# Altium project PCB_Project1.PrjPCB
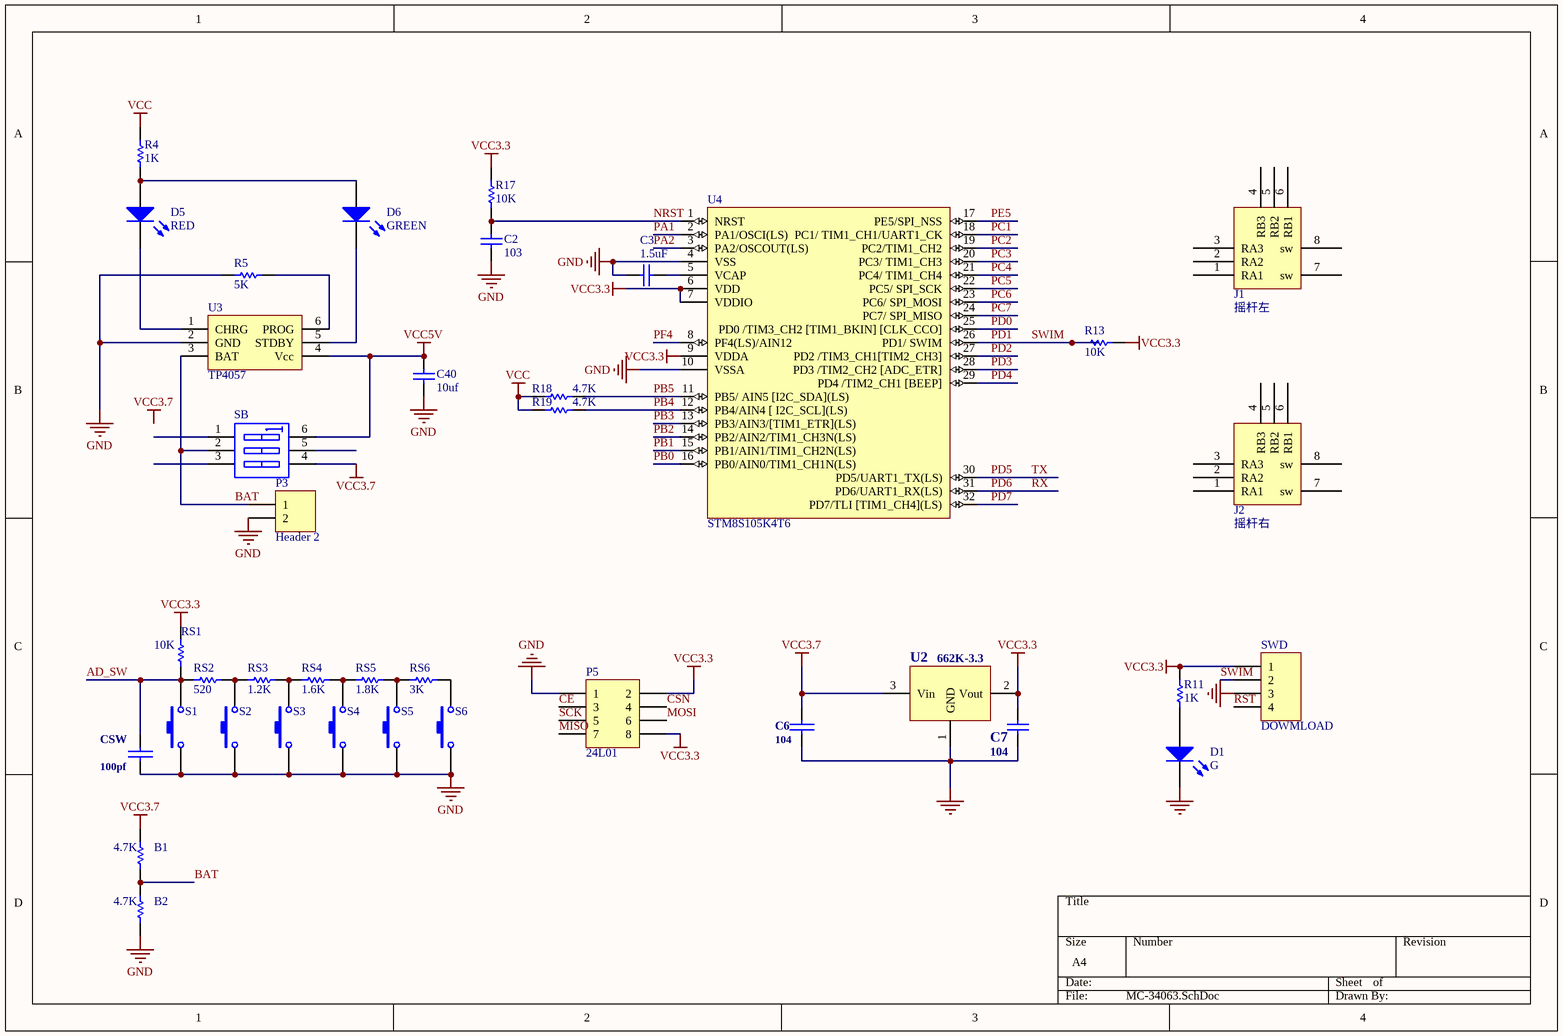
[diagram p0: MC-34063.SchDoc]
1 sheet, 39 parts. Net scope: global (net labels, ports and power ports of the same name join across sheets).
Board file: PCB1.PcbDoc

## Sheet MC-34063.SchDoc
size A4

### Parts
B1  value 4.7K  [6-0805_L]  (hidden comment: Res1)
B2  value 4.7K  [6-0805_L]  (hidden comment: Res1)
C2  value 103  [CAPC2012L]  (hidden comment: Cap)
C3  value 1.5uF  [CAPC2012L]  (hidden comment: Cap)
C6  104  [6-0805_L]
C7  104  [6-0805_l]
C40  value 10uf  [CAPC2012L]  (hidden comment: Cap)
CSW  100pf  [6-0805_L]
D1  G  [6-0805_L]
D5  RED  [CD2012-0805]
D6  GREEN  [CD2012-0805]
J1  摇杆左  [摇杆]
J2  摇杆右  [摇杆]
P3  Header 2  [HDR1X2]
P5  24L01  [HDR2X4]
R4  value 1K  [RESC2012L]  (hidden comment: Res1)
R5  value 5K  [RESC2012L]  (hidden comment: Res1)
R11  value 1K  [6-0805_L]  (hidden comment: Res1)
R13  value 10K  [6-0805_L]  (hidden comment: Res1)
R17  value 10K  [RESC2012L]  (hidden comment: Res1)
R18  value 4.7K  [resc2012l]  (hidden comment: Res1)
R19  value 4.7K  [resc2012l]  (hidden comment: Res1)
RS1  value 10K  [6-0805_L]  (hidden comment: Res1)
RS2  value 520  [6-0805_L]  (hidden comment: Res1)
RS3  value 1.2K  [6-0805_L]  (hidden comment: Res1)
RS4  value 1.6K  [6-0805_L]  (hidden comment: Res1)
RS5  value 1.8K  [6-0805_L]  (hidden comment: Res1)
RS6  value 3K  [6-0805_L]  (hidden comment: Res1)
S1  SW-PB  [SPST-2]  (value not drawn)
S2  SW-PB  [SPST-2]  (value not drawn)
S3  SW-PB  [SPST-2]  (value not drawn)
S4  SW-PB  [SPST-2]  (value not drawn)
S5  SW-PB  [SPST-2]  (value not drawn)
S6  SW-PB  [SPST-2]  (value not drawn)
SB  SW DIP-3  [sw-slk]  (value not drawn)
SWD  DOWMLOAD  [HDR1X4]
U2  662K-3.3  [SOT-23_L]
U3  TP4057  [SOT23-6_L]
U4  STM8S105K4T6  [LQLPF32]

### Nets
GND: B2.1 C2.1 C3.2 C6.2 C7.1 C40.1 CSW.2 D1.2(K) P3.2 P5.1 R5.2 S1.1 S2.1 S3.1 S4.1 S5.1 S6.1 SWD.3 U2.1(GND) U3.2(GND) U4.4(VSS) U4.10(VSSA)
VCC: R4.2 R18.2 R19.2
VCC3.3: C7.2 P5.2 P5.8 R11.2 R13.2 R17.2 RS1.2 SWD.1 U2.2(Vout) U4.6(VDD) U4.7(VDDIO) U4.9(VDDA)
VCC3.7: B1.2 C6.1 SB.4(B3) U2.3(Vin)
VCC5V: C40.2 SB.6(B1) U3.4(Vcc)
AD_SW: CSW.1 RS1.1 RS2.2 S1.2
BAT: B1.1 B2.2 P3.1 SB.2(A2) U3.3(BAT)
CE: P5.3
CSN: P5.4
MISO: P5.7
MOSI: P5.6
NRST: C2.2 R17.1 U4.1(NRST)
PA1: U4.2(PA1/OSCI(LS))
PA2: U4.3(PA2/OSCOUT(LS))
PB0: U4.16(PB0/AIN0/TIM1_CH1N(LS))
PB1: U4.15(PB1/AIN1/TIM1_CH2N(LS))
PB2: U4.14(PB2/AIN2/TIM1_CH3N(LS))
PB3: U4.13(PB3/AIN3/[TIM1_ETR](LS))
PB4: R19.1 U4.12(PB4/AIN4_[_I2C_SCL](LS))
PB5: R18.1 U4.11(PB5/_AIN5_[I2C_SDA](LS))
PC1: U4.18(PC1/_TIM1_CH1/UART1_CK)
PC2: U4.19(PC2/TIM1_CH2)
PC3: U4.20(PC3/_TIM1_CH3)
PC4: U4.21(PC4/_TIM1_CH4)
PC5: U4.22(PC5/_SPI_SCK)
PC6: U4.23(PC6/_SPI_MOSI)
PC7: U4.24(PC7/_SPI_MISO)
PD0: U4.25(PD0_/TIM3_CH2_[TIM1_BKIN]_[CLK_CCO])
PD1: R13.1 SWD.2 U4.26(PD1/_SWIM)  [also labelled SWIM]
PD2: U4.27(PD2_/TIM3_CH1[TIM2_CH3])
PD3: U4.28(PD3_/TIM2_CH2_[ADC_ETR])
PD4: U4.29(PD4_/TIM2_CH1_[BEEP])
PD5: U4.30(PD5/UART1_TX(LS))  [also labelled TX]
PD6: U4.31(PD6/UART1_RX(LS))  [also labelled RX]
PD7: U4.32(PD7/TLI_[TIM1_CH4](LS))
PE5: U4.17(PE5/SPI_NSS)
PF4: U4.8(PF4(LS)/AIN12)
RST: SWD.4
SCK: P5.5
NetC3_1: C3.1 U4.5(VCAP)
NetD1_1: D1.1(A) R11.1
NetD5_1: D5.1(A) D6.1(A) R4.1
NetD5_2: D5.2(K) U3.1(CHRG)
NetD6_2: D6.2(K) U3.5(STDBY)
NetR5_1: R5.1 U3.6(PROG)
NetRS2_1: RS2.1 RS3.2 S2.2
NetRS3_1: RS3.1 RS4.2 S3.2
NetRS4_1: RS4.1 RS5.2 S4.2
NetRS5_1: RS5.1 RS6.2 S5.2
NetRS6_1: RS6.1 S6.2

Not connected (* = marked no-connect by the designer): J1 1(RA1) 2(RA2) 3(RA3) 4(RB3) 5(RB2) 6(RB1) 7(sw) 8(sw); J2 1(RA1) 2(RA2) 3(RA3) 4(RB3) 5(RB2) 6(RB1) 7(sw) 8(sw); SB 1(A1) 3(A3) 5(B2)

### Notes on the sheet
- Labels drawn without touching a wire or pin: VCC3.7

### Library data of the parts
B1 B2 R4 R5 R11 R13 R17-R19 RS1-RS6 = Res1: Resistor; Published: 8-Jun-2000; LatestRevisionDate: 17-Jul-2002; LatestRevisionNote: Re-released for DXP Platform.; PackageReference: AXIAL-0.3; Publisher: Altium Limited; PackageDescription: Axial Device, Thru-Hole; 2 Leads; 0.3 in Pin Spacing
C2 C3 C7 C40 = Cap: Capacitor
  C2 C3 C40: Published: 8-Jun-2000; LatestRevisionDate: 17-Jul-2002; LatestRevisionNote: Re-released for DXP Platform.; PackageReference: RAD-0.3; Publisher: Altium Limited; PackageDescription: Radial Cap, Thru-Hole; 2 Leads; 0.3 in Pin Spacing
  C7: Part Field 1: 8-Jun-2000; Part Field 2: 17-Jul-2002; Part Field 3: Re-released for DXP Platform.; Part Field 4: Altium Limited; Part Field 5: 0.01uF
C6 CSW = CAP: Capacitor
D1 D5 D6 = LED3: Typical BLUE SiC LED; Published: 8-Jun-2000; LatestRevisionDate: 17-Dec-2003; LatestRevisionNote: PCB Footprint replaced.; DatasheetVersion: 16-Apr-2002; PackageVersion: 16-Apr-2002; PackageReference: 3.5X2.8X1.9; Publisher: Altium Limited; PackageDescription: SM LED; 2 C-Bend Leads; Body 3.5 x 2.8 x 1.9 mm, inc leads (LxWxH typ)
J1 J2 = Component_1
P3 = Header 2: Header, 2-Pin; LatestRevisionDate: 17-Jul-2002; LatestRevisionNote: Re-released for DXP Platform.; Publisher: Altium Limited
P5 = Header 4X2: Header, 4-Pin, Dual row; LatestRevisionDate: 17-Jul-2002; LatestRevisionNote: Re-released for DXP Platform.; Publisher: Altium Limited
S1-S6 = SW-PB: Switch; Published: 24-Mar-1999; LatestRevisionDate: 17-Jul-2002; LatestRevisionNote: Re-released for DXP Platform.; PackageReference: SPST-2; Publisher: Altium Limited; PackageDescription: Switch; 2 Leads
SB = SW DIP-3: DIP Switch, 3 Position, SPST; Published: 24-Mar-1999; LatestRevisionDate: 17-Jul-2002; LatestRevisionNote: Re-released for DXP Platform.; PackageReference: DIP-6; Publisher: Altium Limited; Code_JEDEC: MO-001-AM
SWD = Header 4: Header, 4-Pin; LatestRevisionDate: 17-Jul-2002; LatestRevisionNote: Re-released for DXP Platform.; Publisher: Altium Limited
U2 = 78MXX: three terminal regulator
U3 = TP4057: 500mA单节锂离子电池充电器
U4 = STM8S105K4T6: STM8 Microcontroller with 16K Bytes Flash Memory 32PIN LQFP32; PackageDocument: revB, Oct-2001; Published: 17-Sep-2003; LatestRevisionDate: 4-Mar-2005; LatestRevisionNote: Stylized 3D Model Added.; DatasheetDocument: 2486H-AVR-09/02; PackageReference: 32A; Publisher: Altium Limited; Code_JEDEC: MS-026-ABA; ComponentLink1Description: Manufacturer Link; ComponentLink1URL: http://www.atmel.com; ComponentLink2Description: Datasheet; ComponentLink2URL: http://www.atmel.com/dyn/resources/prod_documents/doc2486.pdf